# EAGLE design Mirley_ESP8266 (EAGLE 9.5.1)

## Sheet 1 of 2: Mirley board to evaluate ESP8266
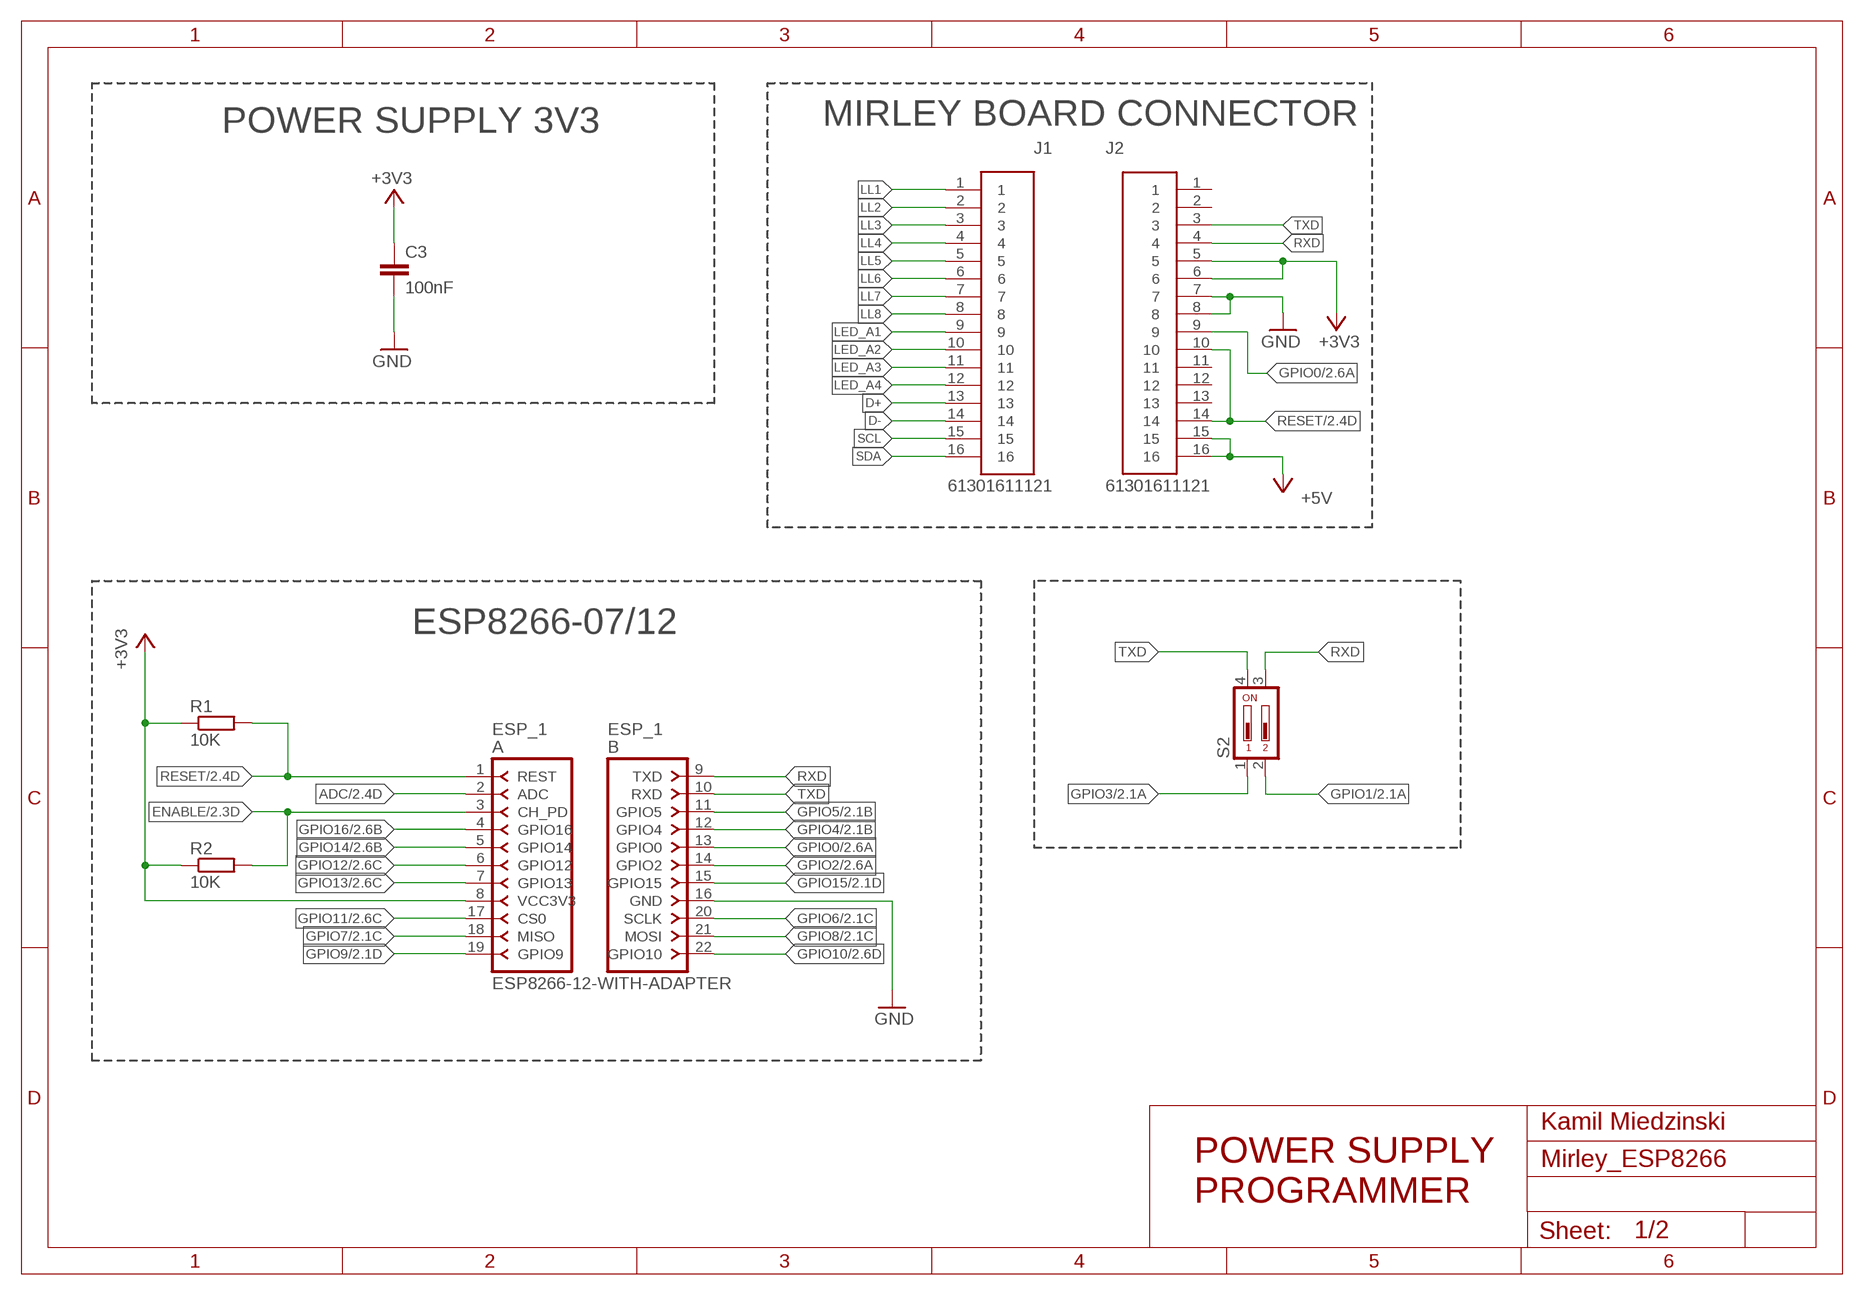
[diagram p0: schematic, sheet 1]

### Parts
C3  100nF  C-EUC0805K  [C0805K]
ESP_1  ESP8266-12-WITH-ADAPTER  [ESP8266-12-ADAPTER]
J1  61301611121  [61301611121]
J2  61301611121  [61301611121]
R1  10K  R-EU_R0805  [R0805]
R2  10K  R-EU_R0805  [R0805]
S2  DIP02YL  [DIP02YL]

### Nets
+3V3: C3.1 ESP_1.8(VCC3V3) J2.5 J2.6 R1.1 R2.1 ; also sheet 2
+5V: J2.15 J2.16 ; also sheet 2
ADC: ESP_1.2(ADC) ; also sheet 2
D+: J1.13
D-: J1.14
ENABLE: ESP_1.3(CH_PD) R2.2 ; also sheet 2
GND: C3.2 ESP_1.16(GND) J2.7 J2.8 ; also sheet 2
GPIO0: ESP_1.13(GPIO0) J2.9 ; also sheet 2
GPIO1: S2.2 ; also sheet 2
GPIO2: ESP_1.14(GPIO2) ; also sheet 2
GPIO3: S2.1 ; also sheet 2
GPIO4: ESP_1.12(GPIO4) ; also sheet 2
GPIO5: ESP_1.11(GPIO5) ; also sheet 2
GPIO6: ESP_1.20(SCLK) ; also sheet 2
GPIO7: ESP_1.18(MISO) ; also sheet 2
GPIO8: ESP_1.21(MOSI) ; also sheet 2
GPIO9: ESP_1.19(GPIO9) ; also sheet 2
GPIO10: ESP_1.22(GPIO10) ; also sheet 2
GPIO11: ESP_1.17(CS0) ; also sheet 2
GPIO12: ESP_1.6(GPIO12) ; also sheet 2
GPIO13: ESP_1.7(GPIO13) ; also sheet 2
GPIO14: ESP_1.5(GPIO14) ; also sheet 2
GPIO15: ESP_1.15(GPIO15) ; also sheet 2
GPIO16: ESP_1.4(GPIO16) ; also sheet 2
LED_A1: J1.9 ; also sheet 2
LED_A2: J1.10 ; also sheet 2
LED_A3: J1.11 ; also sheet 2
LED_A4: J1.12 ; also sheet 2
LL1: J1.1 ; also sheet 2
LL2: J1.2 ; also sheet 2
LL3: J1.3 ; also sheet 2
LL4: J1.4 ; also sheet 2
LL5: J1.5 ; also sheet 2
LL6: J1.6 ; also sheet 2
LL7: J1.7 ; also sheet 2
LL8: J1.8 ; also sheet 2
RESET: ESP_1.1(REST) J2.10 J2.14 R1.2 ; also sheet 2
RXD: ESP_1.9(TXD) J2.4 S2.3
SCL: J1.15 ; also sheet 2
SDA: J1.16 ; also sheet 2
TXD: ESP_1.10(RXD) J2.3 S2.4
Unconnected: J2.1 J2.2 J2.11 J2.12 J2.13

### Notes on the sheet
- POWER SUPPLY 3V3 | MIRLEY BOARD CONNECTOR
- ESP8266-07/12
- Kamil Miedzinski
- POWER SUPPLY
  PROGRAMMER

## Sheet 2 of 2: LOGIC LEVEL CONVERTER 3,3V - 5V
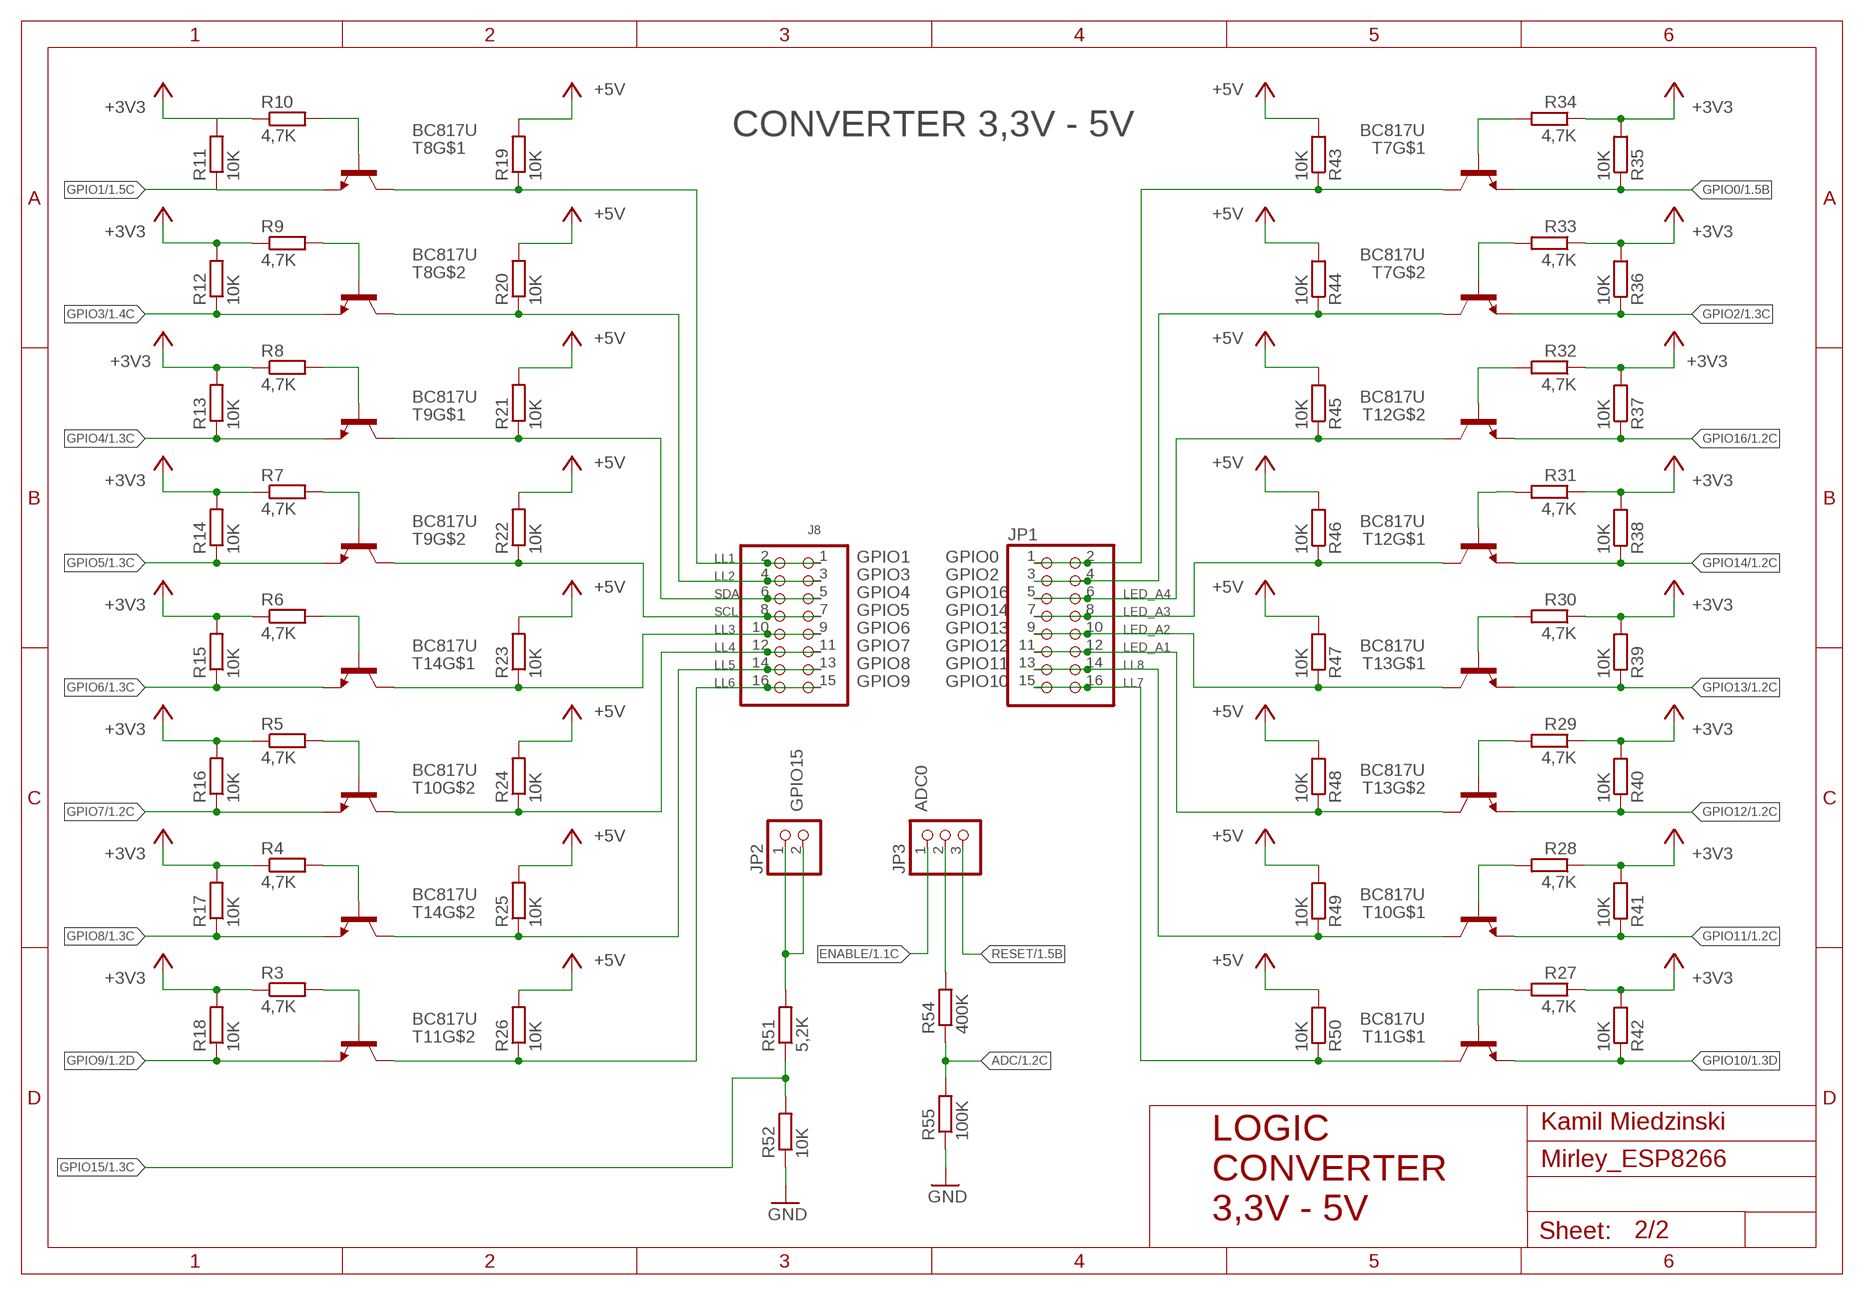
[diagram p1: schematic, sheet 2]

### Parts
J8  PINHD-2X8  [2X08]
JP1  PINHD-2X8  [2X08]
JP2  PINHD-1X2  [1X02]
JP3  PINHD-1X3  [1X03]
R3  4,7K  R-EU_R0603  [R0603]
R4  4,7K  R-EU_R0603  [R0603]
R5  4,7K  R-EU_R0603  [R0603]
R6  4,7K  R-EU_R0603  [R0603]
R7  4,7K  R-EU_R0603  [R0603]
R8  4,7K  R-EU_R0603  [R0603]
R9  4,7K  R-EU_R0603  [R0603]
R10  4,7K  R-EU_R0603  [R0603]
R11  10K  R-EU_R0805  [R0805]
R12  10K  R-EU_R0805  [R0805]
R13  10K  R-EU_R0805  [R0805]
R14  10K  R-EU_R0805  [R0805]
R15  10K  R-EU_R0805  [R0805]
R16  10K  R-EU_R0805  [R0805]
R17  10K  R-EU_R0805  [R0805]
R18  10K  R-EU_R0805  [R0805]
R19  10K  R-EU_R0805  [R0805]
R20  10K  R-EU_R0805  [R0805]
R21  10K  R-EU_R0805  [R0805]
R22  10K  R-EU_R0805  [R0805]
R23  10K  R-EU_R0805  [R0805]
R24  10K  R-EU_R0805  [R0805]
R25  10K  R-EU_R0805  [R0805]
R26  10K  R-EU_R0805  [R0805]
R27  4,7K  R-EU_R0603  [R0603]
R28  4,7K  R-EU_R0603  [R0603]
R29  4,7K  R-EU_R0603  [R0603]
R30  4,7K  R-EU_R0603  [R0603]
R31  4,7K  R-EU_R0603  [R0603]
R32  4,7K  R-EU_R0603  [R0603]
R33  4,7K  R-EU_R0603  [R0603]
R34  4,7K  R-EU_R0603  [R0603]
R35  10K  R-EU_R0805  [R0805]
R36  10K  R-EU_R0805  [R0805]
R37  10K  R-EU_R0805  [R0805]
R38  10K  R-EU_R0805  [R0805]
R39  10K  R-EU_R0805  [R0805]
R40  10K  R-EU_R0805  [R0805]
R41  10K  R-EU_R0805  [R0805]
R42  10K  R-EU_R0805  [R0805]
R43  10K  R-EU_R0805  [R0805]
R44  10K  R-EU_R0805  [R0805]
R45  10K  R-EU_R0805  [R0805]
R46  10K  R-EU_R0805  [R0805]
R47  10K  R-EU_R0805  [R0805]
R48  10K  R-EU_R0805  [R0805]
R49  10K  R-EU_R0805  [R0805]
R50  10K  R-EU_R0805  [R0805]
R51  5,2K  R-EU_R0805  [R0805]
R52  10K  R-EU_R0805  [R0805]
R54  400K  R-EU_R0805  [R0805]
R55  100K  R-EU_R0805  [R0805]
T7  BC817U  [INF-SC74]
T8  BC817U  [INF-SC74]
T9  BC817U  [INF-SC74]
T10  BC817U  [INF-SC74]
T11  BC817U  [INF-SC74]
T12  BC817U  [INF-SC74]
T13  BC817U  [INF-SC74]
T14  BC817U  [INF-SC74]

### Nets
+3V3: R3.1 R4.1 R5.1 R6.1 R7.1 R8.1 R9.1 R10.1 R11.2 R12.2 R13.2 R14.2 R15.2 R16.2 R17.2 R18.2 R27.1 R28.1 R29.1 R30.1 R31.1 R32.1 R33.1 R34.1 R35.2 R36.2 R37.2 R38.2 R39.2 R40.2 R41.2 R42.2 ; also sheet 1
+5V: R19.2 R20.2 R21.2 R22.2 R23.2 R24.2 R25.2 R26.2 R43.2 R44.2 R45.2 R46.2 R47.2 R48.2 R49.2 R50.2 ; also sheet 1
ADC: R54.1 R55.2 ; also sheet 1
ENABLE: JP3.1 ; also sheet 1
GND: R52.1 R55.1 ; also sheet 1
GPIO0: R35.1 T7.1(E) ; also sheet 1
GPIO1: R11.1 T8.1(E) ; also sheet 1
GPIO2: R36.1 T7.4(E) ; also sheet 1
GPIO3: R12.1 T8.4(E) ; also sheet 1
GPIO4: R13.1 T9.1(E) ; also sheet 1
GPIO5: R14.1 T9.4(E) ; also sheet 1
GPIO6: R15.1 T14.1(E) ; also sheet 1
GPIO7: R16.1 T10.4(E) ; also sheet 1
GPIO8: R17.1 T14.4(E) ; also sheet 1
GPIO9: R18.1 T11.4(E) ; also sheet 1
GPIO10: R42.1 T11.1(E) ; also sheet 1
GPIO11: R41.1 T10.1(E) ; also sheet 1
GPIO12: R40.1 T13.4(E) ; also sheet 1
GPIO13: R39.1 T13.1(E) ; also sheet 1
GPIO14: R38.1 T12.1(E) ; also sheet 1
GPIO15: JP2.1 JP2.2 R51.1 R51.2 R52.2 ; also sheet 1
GPIO16: R37.1 T12.4(E) ; also sheet 1
LED_A1: JP1.11 JP1.12 R48.1 T13.3(C) ; also sheet 1
LED_A2: JP1.9 JP1.10 R47.1 T13.6(C) ; also sheet 1
LED_A3: JP1.7 JP1.8 R46.1 T12.6(C) ; also sheet 1
LED_A4: JP1.5 JP1.6 R45.1 T12.3(C) ; also sheet 1
LL1: J8.1 J8.2 R19.1 T8.6(C) ; also sheet 1
LL2: J8.3 J8.4 R20.1 T8.3(C) ; also sheet 1
LL3: J8.9 J8.10 R23.1 T14.6(C) ; also sheet 1
LL4: J8.11 J8.12 R24.1 T10.3(C) ; also sheet 1
LL5: J8.13 J8.14 R25.1 T14.3(C) ; also sheet 1
LL6: J8.15 J8.16 R26.1 T11.3(C) ; also sheet 1
LL7: JP1.15 JP1.16 R50.1 T11.6(C) ; also sheet 1
LL8: JP1.13 JP1.14 R49.1 T10.6(C) ; also sheet 1
N$1: JP1.3 JP1.4 R44.1 T7.3(C)
N$2: JP3.2 R54.2
N$3: JP1.1 JP1.2 R43.1 T7.6(C)
N$4: R34.2 T7.2(B)
N$6: R10.2 T8.2(B)
N$7: R9.2 T8.5(B)
N$8: R33.2 T7.5(B)
N$12: R8.2 T9.2(B)
N$14: R32.2 T12.5(B)
N$15: R31.2 T12.2(B)
N$16: R7.2 T9.5(B)
N$20: R6.2 T14.2(B)
N$22: R30.2 T13.2(B)
N$24: R29.2 T13.5(B)
N$26: R5.2 T10.5(B)
N$27: R28.2 T10.2(B)
N$28: R4.2 T14.5(B)
N$31: R27.2 T11.2(B)
N$33: R3.2 T11.5(B)
RESET: JP3.3 ; also sheet 1
SCL: J8.7 J8.8 R22.1 T9.3(C) ; also sheet 1
SDA: J8.5 J8.6 R21.1 T9.6(C) ; also sheet 1

### Notes on the sheet
- CONVERTER 3,3V - 5V
- GPIO1 | GPIO0
- GPIO3 | GPIO2
- GPIO4 | GPIO16
- GPIO5 | GPIO14
- GPIO6 | GPIO13
- GPIO7 | GPIO12
- GPIO8 | GPIO11
- GPIO9 | GPIO10
- GPIO15 | ADC0
- Kamil Miedzinski
- LOGIC
  CONVERTER 
  3,3V - 5V

## Library data of the parts
C3 = rcl:C-EU: CAPACITOR, European symbol; SPICEPREFIX: C
ESP_1 = esp8266_with_adapter:ESP8266-12-WITH-ADAPTER: ESP8266 Adapter for ESP8266-03, ESP8266-04, ESP8266-07, ESP8266-08, ESP8266-12 and similar. (c) by Bartosz Batorek obi--wan@wp.pl
J1 J2 = Headers:61301611121: CONN HEADER VERT 16POS 2.54MM Manufacturer's datasheet <https://katalog.we-online.de/em/datasheet/6130xx11121.pdf>; CREATED_BY: PCBLayout.com; DIGIKEY_PART_NUMBER: 732-5327-ND; MANUFACTURER: Wurth Electronics Inc.; MPN: 61301611121
J8 JP1 = pinhead:PINHD-2X8: PIN HEADER
JP2 = pinhead:PINHD-1X2: PIN HEADER
JP3 = pinhead:PINHD-1X3: PIN HEADER
R1-R52 R54 R55 = rcl:R-EU_: RESISTOR, European symbol; SPICEPREFIX: R
S2 = switch-dil:DIP02YL: DIL/CODE SWITCH; OC_FARNELL: unknown; OC_NEWARK: unknown
T7-T14 = transistor:BC817U: NPN TRANSISTOR

## Board
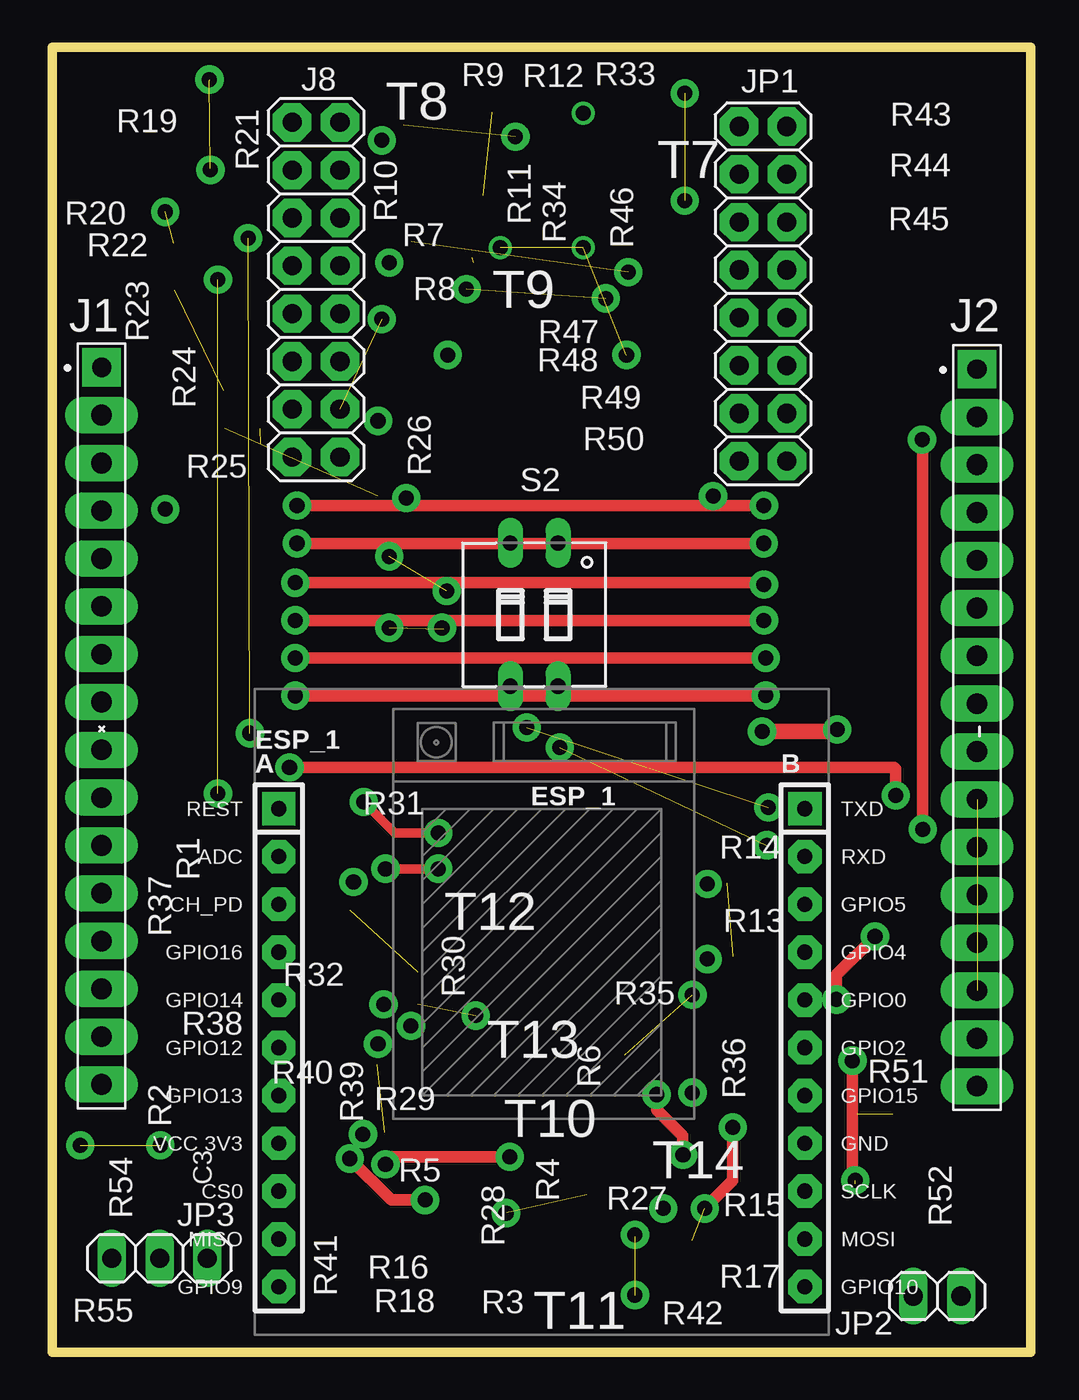
[diagram p2: board, top side]
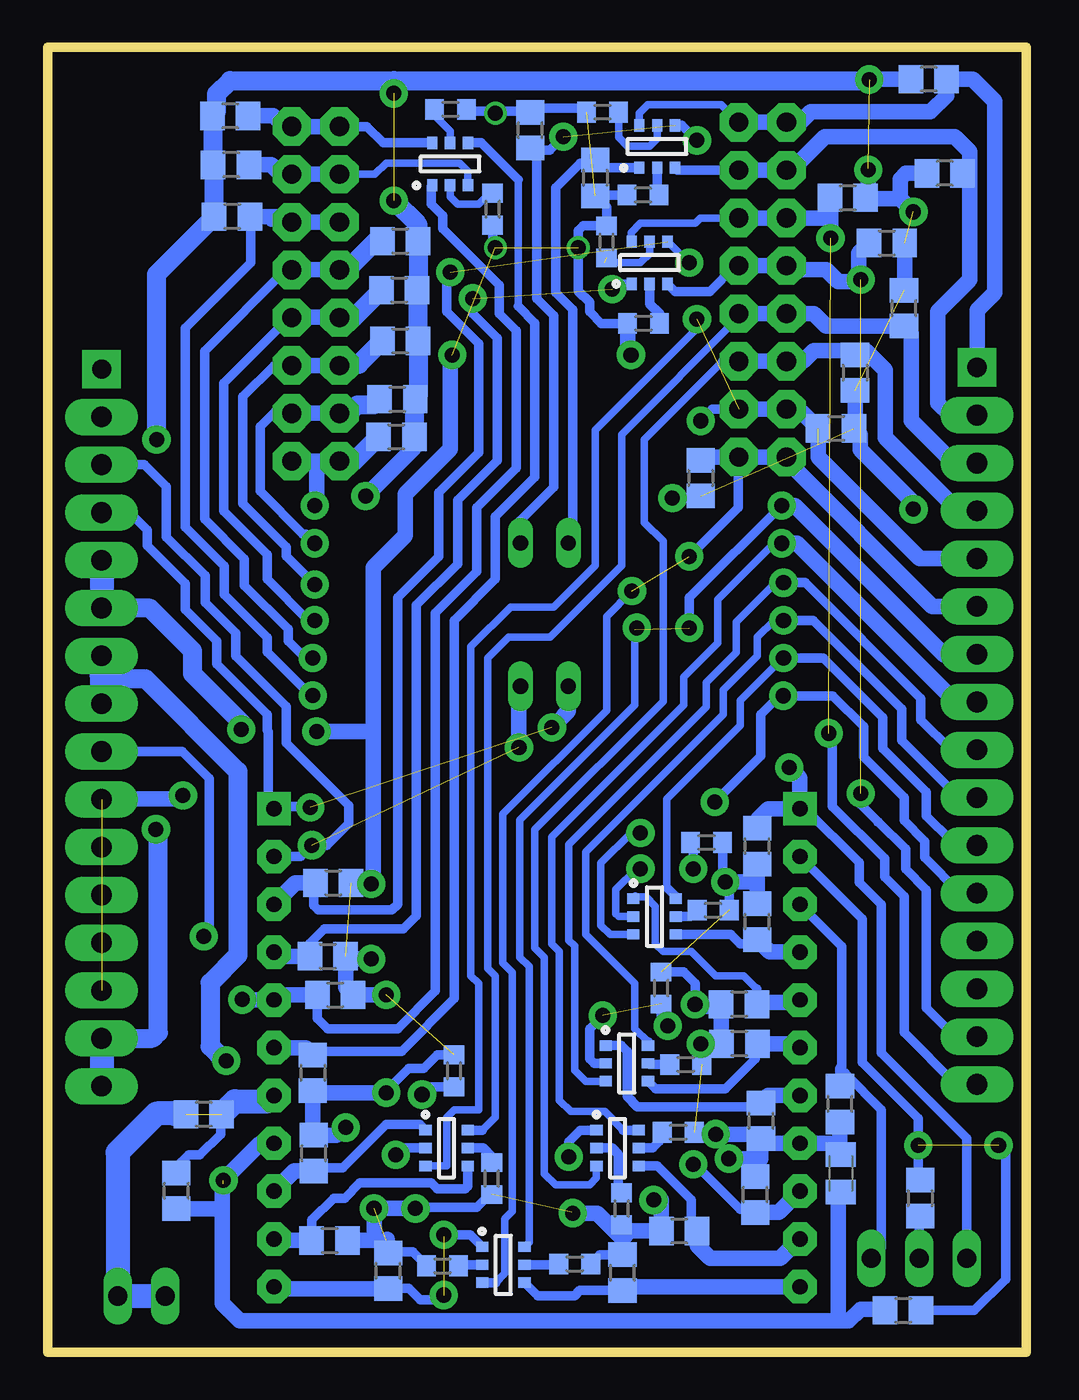
[diagram p3: board, bottom side, seen from below]

Size 51.97 x 69.36 mm. Coordinates in mm from the lower left corner, seen from the top.
Outline: 0,0 51.97,0 51.97,69.36 0,69.36 0,0
Copper layers (1*16): Top 0.035mm / dielectric 1.5mm / Bottom 0.035mm
Design rules "default *": minimum track width 6mil, minimum drill 0.35mm, track to track 20mil, track to pad 20mil, pad to pad 20mil, via to via 20mil, smd to smd 6mil, copper to edge 40mil, drill to drill 6mil, minimum pad ring 10mil, minimum via ring 8mil, stop-mask expansion 4mil, vias tented up to drill 0mil, thermal gap 10mil

### Footprints (pad centres in the part's own frame; a part is rotated, then mirrored left to right if it is on the bottom)
C0805K = smd 1.3 x 1.6: 1 -1,0; 2 1,0
ESP8266-12-ADAPTER = drill 0.813 pad 1.778 square: 1 -13.97,8.89; 9 13.97,8.89 | drill 0.813 pad 1.778 octagon: 2 -13.97,6.35; 3 -13.97,3.81; 4 -13.97,1.27; 5 -13.97,-1.27; 6 -13.97,-3.81; 7 -13.97,-6.35; 8 -13.97,-8.89; 10 13.97,6.35; 11 13.97,3.81; 12 13.97,1.27; 13 13.97,-1.27; 14 13.97,-3.81; 15 13.97,-6.35; 16 13.97,-8.89; 17 -13.97,-11.43; 18 -13.97,-13.97; 19 -13.97,-16.51; 20 13.97,-11.43; 21 13.97,-13.97; 22 13.97,-16.51
61301611121 = drill 1.016 pad 2.032 square: 1 -19.05,0 | drill 1.1 pad 1.93 long: 2 -16.51,0; 3 -13.97,0; 4 -11.43,0; 5 -8.89,0; 6 -6.35,0; 7 -3.81,0; 8 -1.27,0; 9 1.27,0; 10 3.81,0; 11 6.35,0; 12 8.89,0; 13 11.43,0; 14 13.97,0; 15 16.51,0; 16 19.05,0
2X08 = drill 1.016 pad 2.032 octagon: 1 -8.89,-1.27; 2 -8.89,1.27; 3 -6.35,-1.27; 4 -6.35,1.27; 5 -3.81,-1.27; 6 -3.81,1.27; 7 -1.27,-1.27; 8 -1.27,1.27; 9 1.27,-1.27; 10 1.27,1.27; 11 3.81,-1.27; 12 3.81,1.27; 13 6.35,-1.27; 14 6.35,1.27; 15 8.89,-1.27; 16 8.89,1.27
1X02 = drill 1.016 long: 1 -1.27,0; 2 1.27,0
1X03 = drill 1.016 long: 1 -2.54,0; 2 0,0; 3 2.54,0
R0805 = smd 1.3 x 1.5: 1 -0.95,0; 2 0.95,0
R0603 = smd 1 x 1.1: 1 -0.85,0; 2 0.85,0
DIP02YL = drill 0.813 long: 1 -1.27,-3.81; 2 1.27,-3.81; 3 1.27,3.81; 4 -1.27,3.81
INF-SC74 = smd 0.65 x 0.55: 1 -1.125,0.95; 2 -1.125,0; 3 -1.125,-0.95; 4 1.125,-0.95; 5 1.125,0; 6 1.125,0.95

### Placement (x,y rotation side)
C3  9.85,9.51 270 bottom
ESP_1  26,20 0 top
J1  2.62,33.29 270 top
J2  49.12,33.2 270 top
J8  14.01,56.47 270 top
JP1  37.75,56.25 270 top
JP2  47,3 0 top
JP3  5.7,5 180 top
R1  14.3,26.9 90 bottom
R2  9.9,13.2 90 bottom
R3  23.99,4.7 180 bottom
R4  28.4,9.24 90 bottom
R5  18.49,11.7 180 bottom
R6  30.4,14.96 270 bottom
R7  22.3,59.01 270 bottom
R8  20.34,54.68 0 bottom
R9  22.51,65.9 0 bottom
R10  20.36,61.5 0 bottom
R11  22.9,62.41 270 bottom
R12  26.35,64.94 90 bottom
R13  37.11,21.05 0 bottom
R14  36.81,24.95 0 bottom
R15  37.85,10.59 90 bottom
R16  18.44,6.45 180 bottom
R17  37.01,5.95 0 bottom
R18  21.45,4.24 90 bottom
R19  5.19,67.65 180 bottom
R20  4.34,62.65 180 bottom
R21  9.49,61.35 0 bottom
R22  7.41,58.95 0 bottom
R23  6.5,55.49 90 bottom
R24  9.1,52.06 270 bottom
R25  10.11,49.1 0 bottom
R26  17.3,46.46 270 bottom
R27  31.01,4.6 0 bottom
R28  21.5,7.64 90 bottom
R29  18.09,15.3 180 bottom
R30  19.4,19.36 270 bottom
R31  16.99,27.1 180 bottom
R32  16.64,23.5 180 bottom
R33  30.59,66.05 180 bottom
R34  28.35,60.74 90 bottom
R35  36.71,19 0 bottom
R36  37.9,14.86 270 bottom
R37  14.3,22.89 90 bottom
R38  15.26,18.5 180 bottom
R39  14.1,12.31 270 bottom
R40  15.24,16.4 180 bottom
R41  14.4,8.39 90 bottom
R42  33.9,4.34 90 bottom
R43  42.29,65.7 180 bottom
R44  42.24,63.1 180 bottom
R45  42.19,60.35 180 bottom
R46  33.26,59.05 0 bottom
R47  33.31,56.45 0 bottom
R48  33.26,53.75 0 bottom
R49  33.41,50.65 0 bottom
R50  33.46,48.65 0 bottom
R51  43.69,12.65 180 bottom
R52  45.15,8.59 90 bottom
R54  5.64,8.2 270 bottom
R55  6.55,2.24 0 bottom
S2  25.6,39.2 180 top
T7  30.61,63.14 90 bottom
T8  19.61,64.07 90 bottom
T9  20.01,57.9 90 bottom
T10  21.71,10.86 0 bottom
T11  27.78,4.66 0 bottom
T12  19.75,23.16 0 bottom
T13  21.22,15.36 0 bottom
T14  30.79,10.86 0 bottom

### Tracks (layer width: path | path; a pad name or v marks a point on that pad's centre or on a via)
+3V3  (via drill 0.8, 0.8 pad 1.5)  (9 unrouted)
  Top 0.508: 32.6,7.5 v32.45,7.65
  Top 0.61: v36.15,11.95 36.15,9.15 v34.65,7.65 | v19.8,8.1 18,8.1 v15.8,10.3
  Top 0.813: v41.7,33.1 41.6,33 v37.7,33 | v24.1,7.4 24.15,7.45
  Bottom 0.508: R18.2 22.65,5.19 R3.1 | R27.1 32.6,5.34 33.95,5.34 | R28.1 21.5,6.1 21.45,6.05 | R5.1 16.6,11.7 v16.5,11.6 | R4.1 28.51,8.39 29.2,7.7 32.4,7.7 v32.45,7.65 | R6.1 31.29,15.81 32,15.1 32.8,15.1 34,13.9 v34,13.8 | R29.1 17.3,15.36 v17.3,16.4 | v17.6,18.5 17.6,19.6 18.21,20.21 R30.1 | R32.1 15.79,24.79 v16,25 16.14,25.14 R31.1 | 21.21,61.3 R10.1 22.86,61.5 R11.2 | R9.1 23.56,66.1 26.14,66.1 R12.2 26.41,65.95 28.1,65.95 v28.2,65.85 28.3,65.95 29.64,65.95 R33.1 | R11.2 22.96,61.4 | R11.2 22.3,60.86 R7.1 | 21.21,54.7 R8.1 22.58,54.68 23.2,55.3 23.2,55.8 23.8,56.4 v23.8,58.7 23.8,59.6 23.54,59.86 R7.1 | 22.54,60.1 R7.1 | R34.1 28.35,58.85 v28.2,58.7
  Bottom 0.813: R2.1 9.9,10.56 C3.1 10.45,11.11 ESP_1.8 13.85,11.11 R39.2 | 37.1,33 v37.7,33 34.7,33 | R1.1 14.3,25 | 14.3,25 R37.2 | 21.45,6.05 R18.2 | 21.45,6.05 21.05,6.45 R16.2 19.39,8.1 v19.8,8.1 | R41.2 14.4,10.3 | R39.2 14.1,10.3 14.4,10.3 | v34.8,24.9 34.85,24.95 R14.2 34.7,24.95 34.7,33 | v34.8,20.9 36.01,20.9 R13.2 36.16,19.4 R35.2 v34,19 | v34,13.8 37.79,13.8 R36.2 37.9,11.59 R15.2 36.66,11.54 36.25,11.95 v36.15,11.95 | v32.45,7.65 v34.65,7.65 34.65,5.95 R17.2 | v24.1,7.4 22.8,7.4 21.45,6.05 | R42.2 33.95,5.34 33.95,6 34,5.95 | v15.8,10.3 14.4,10.3 | R39.2 14.34,11.6 v16.5,11.6 | v17.3,16.4 R40.2 16.21,16.42 R38.2 16.31,18.4 17.5,18.4 v17.6,18.5 | v16,25 14.3,25 | 34.7,33 34.7,41.7 33,43.4 33,45.6 30.6,48 30.6,52.9 v30.5,53 | v21,53 21.19,53.19 R8.1
  Bottom 1.016: v41.7,33.1 41.7,33.47 44.29,36.05 44.29,37.28 46.56,39.55 J2.6
  Bottom 1.27: J2.5 J2.6
+5V  (via drill 0.8 pad 1.5)  (6 unrouted)
  Top 0.61: v46.23,27.8 46.23,48.47
  Top 0.813: 46.23,48.47 v46.2,48.5
  Bottom 0.508: R26.2 17.41,45.4 v18.8,45.4
  Bottom 0.813: R23.2 6.46,56.48 R22.2 | R20.2 6.4,62.65 6.7,62.35 6.7,61.3 | 8.4,62.9 v8.4,62.84 8.4,61.49 | 8.4,61.49 R21.2 | R19.2 8.33,67.65 v8.35,67.64 | R24.2 9.1,49.16 R25.2 8.82,48.76 8.82,47.97 5.8,44.95 5.8,44.7 6,44.7 v6,44.8 | v6,60.6 6.7,61.3 | 8.4,61.49 8.21,61.3 6.7,61.3 | R50.2 32.51,48.09 v35.1,45.5
  Bottom 1.016: J2.15 46.41,16.69 46.1,17 46.1,27.8 v46.23,27.8 | v46.2,48.5 46.2,57.29 R45.2 43.14,63.05 R44.2 43.19,65.65 R43.2 43.01,65.93 43.01,66.87 42.3,67.58 33.6,67.58 | 32.2,59.16 R46.2 | R46.2 32.31,56.45 | 32.31,56.45 R47.2 | 33.6,67.58 8.33,67.58 | v33.6,66.9 33.6,67.58 | R50.2 32.51,50.6 R49.2 32.31,50.8 R48.2 32.31,56.45 | R46.2 32.31,59.91 v33.6,61.2
  Bottom 1.27: J2.15 J2.16
ADC  (via drill 0.8 pad 1.5)  (1 unrouted)
  Bottom 0.508: ESP_1.2 8.72,23.04 8.72,15.43 5.74,12.45 v5.74,11 5.74,9.25 R54.1 | v1.48,11 1.1,10.62 1.1,3.9 2.76,2.24 R55.2
ENABLE
  Bottom 0.508: ESP_1.3 9.8,21.58 9.8,15 | 9.8,15 9.9,15.1 R2.2 | JP3.1 7.7,5.54 7.7,12.9 9.6,14.8 9.8,15
GND  (via drill 0.8 pad 1.5)  (1 unrouted)
  Top 0.61: v42.5,15.5 42.5,9.3
  Top 1.016: 42.5,9.3 v42.65,9.15
  Bottom 0.813: 10,1.68 41.78,1.68 42.7,2.6 42.7,7.5 | 10,1.68 9.42,1.68 8.8,2.3 7.56,2.3 R55.1 | ESP_1.16 40.69,11.11 v42.65,9.15 | 42.65,8.95 42.7,8.9 42.7,7.5 | R52.1 42.84,7.64 42.7,7.5 | C3.2 10,8.36 10,1.68
  Bottom 1.016: 49.12,36 48.92,35.8 46.8,35.8 41.88,30.88 41.88,21.12 43.35,19.65 43.35,16.25 42.6,15.5 v42.5,15.5
  Bottom 1.27: J2.7 49.12,36 J2.8
GPIO0  (via drill 0.8 pad 1.5)
  Top 0.61: v41.65,18.75 41.65,20.05 v43.7,22.1
  Bottom 0.508: 41.67,18.73 v41.65,18.75 | J2.9 44.83,31.93 43.4,30.5 43.4,22.4 v43.7,22.1 | R35.1 37.66,17.76 37.1,17.2 33.4,17.2 31.4,19.2 31.4,39.3 29.2,41.5 29.2,44.9 27.1,47 27.1,54.3 28,55.2 28,56.7 31,59.7 31,60.4 31.6,61 31.6,61.98 T7.1
  Bottom 0.813: 41.67,18.73 ESP_1.13 39.7,19 R35.1
GPIO1
  Bottom 0.508: T8.1 22.48,62.95 R11.1 23.06,63.2 23.7,63.2 25,61.9 25,56.3 24.1,55.4 24.1,43.24 S2.2
GPIO2
  Bottom 0.406: 27,55.6 27,62.3
  Bottom 0.508: R36.1 37.8,15.81 37.6,16.01 33.19,16.01 30.4,18.8 30.4,38.9 28.2,41.1 28.2,44.4 26.1,46.5 26.1,54.7 27,55.6 | T7.4 28.96,64.27 27,62.3
  Bottom 0.813: ESP_1.14 38.28,16.19 R36.1
GPIO3  (via drill 0.8 pad 1.5)  (1 unrouted)
  Bottom 0.508: T8.4 18.3,65.19 v17.5,64.4 | v24.6,64.6 25.31,63.89 26,63.89 | R12.1 26,63.99 26,63.89 | S2.1 26.87,44.21 25.1,45.98 25.1,55.1 26,56 26,63.89
GPIO4  (via drill 0.8 pad 1.5)  (1 unrouted)
  Bottom 0.508: R13.1 38.06,21.74 37.3,22.5 33.1,22.5 32.4,23.2 32.4,39.7 30.2,41.9 30.2,45.3 28.1,47.4 28.1,53.9 29.4,55.2 v29.4,56 | T9.1 21.93,56.77 22,56.7 v22,56.5
  Bottom 0.813: R13.1 39.75,21.05 ESP_1.12
GPIO5  (via drill 0.8 pad 1.5)  (1 unrouted)
  Bottom 0.406: T9.4 17.93,57.9 v17.9,57.9
  Bottom 0.508: R14.1 37.86,24.85 37.86,23.76 37.6,23.5 33.7,23.5 33.4,23.8 33.4,40.1 31.2,42.3 31.2,45.7 29.1,47.8 29.1,53.6 30.8,55.3 30.8,57.2 v30.6,57.4
  Bottom 0.61: R14.1 38.01,25.2
  Bottom 0.813: R14.1 38.83,24.95 ESP_1.11
GPIO6
  Bottom 0.508: R15.1 37.69,9.8 36.3,9.8 33.99,12.11 32.22,12.11 T14.1
  Bottom 0.813: R15.1 38.9,9.64 ESP_1.20
GPIO7
  Bottom 0.508: R16.1 17.8,6.76 17.8,8.1 19.61,9.91 T10.4
  Bottom 0.813: ESP_1.18 13.06,5 16.8,5 17.49,5.69 R16.1
GPIO8
  Bottom 0.508: R17.1 37.96,7.04 36.8,8.2 36.2,8.2 35.4,9 31.6,9 31.3,8.7 29.8,8.7 29.66,8.84 T14.4
  Bottom 0.813: R17.1 39.89,5.95 ESP_1.21
GPIO9
  Bottom 0.508: R18.1 23.71,3.29 24,3 25.95,3 T11.4
  Bottom 0.813: ESP_1.19 21.25,3.49 R18.1
GPIO10  (via drill 0.8 pad 1.5)  (1 unrouted)
  Top 0.508: 30.95,6.15 30.9,6.2 v30.95,6.25
  Bottom 0.508: R42.1 33.21,3.39 33.2,3.4 32.8,3.4 32.2,2.8 31.1,2.8 30.9,3 v30.95,3.05 | v30.95,6.25 29.55,6.25 T11.1
  Bottom 0.813: R42.1 39.87,3.39 ESP_1.22
GPIO11  (via drill 0.8 pad 1.5)
  Top 0.508: v17.7,10 18.1,10.4 | 24.6,10.4 v24.3,10.4
  Top 0.61: v24.3,10.4 18.1,10.4
  Bottom 0.508: R41.1 14.56,7.6 15.2,7.6 17.6,10 v17.7,10 | T10.1 23.69,11.81 24.3,11.2 v24.3,10.4
  Bottom 0.813: ESP_1.17 13.16,7.44 R41.1
GPIO12
  Bottom 0.508: R40.1 14.4,16.29 14.4,15.6 16,14 19.68,14 T13.4
  Bottom 0.813: ESP_1.6 12.29,16.19 12.5,16.4 R40.1
GPIO13
  Bottom 0.508: R39.1 14.3,13.06 20.66,13.06 21.2,13.6 21.2,16 21.51,16.31 T13.1
  Bottom 0.813: R39.1 13.71,13.65 ESP_1.7
GPIO14
  Bottom 0.406: 14.31,19.31 15,20 16.5,20 17.8,21.3 19.3,21.3 19.7,21.7 19.7,23.7 20.2,24.2 20.79,24.2
  Bottom 0.508: R38.1 14.31,19.31 | 20.79,24.2 T12.1
  Bottom 0.813: ESP_1.5 12.27,18.73 12.4,18.6 14.21,18.6 R38.1
GPIO15  (1 unrouted)
  Bottom 0.508: R51.1 42.8,12.59 42.8,11.6 43.9,10.5 44.5,10.5 45.15,9.85 R52.2
  Bottom 1.27: R51.1 42.04,13.35 40.27,13.35 ESP_1.15 | R51.2 45.15,12.65 45.2,12.7 46.2,12.7 48.27,10.63 JP2.2 JP2.1
GPIO16
  Bottom 0.508: T12.4 15.71,22.21 15.2,21.7 14.54,21.7 R37.1
  Bottom 0.813: ESP_1.4 13.63,21.27 R37.1
LED_A1  (via drill 0.8 pad 1.5)
  Top 0.61: v12.9,40.9 37.7,40.9
  Top 0.813: 37.7,40.9 v37.8,40.8
  Bottom 0.406: T13.3 23.41,14.41 24,15 24,21.6 24.3,21.9 24.3,27 17,34.3 17,35.6 15.4,37.2 15.4,38.8 13.3,40.9
  Bottom 0.508: JP1.12 39.96,52.44 41.62,50.78 41.62,45.12 39.3,42.8 39.3,42.3 v37.8,40.8 37.8,40.9 | J1.9 3.98,32.02 4,32 5.6,33.6 5.6,34.75 11.75,40.9 12.8,40.9 13.3,40.9 | 34,53.96 R48.1
  Bottom 0.813: JP1.11 JP1.12 39.08,52.5 | 12.8,40.9 v12.9,40.9
  Bottom 1.016: R48.1 35.46,52.5 36.42,52.5 JP1.11
LED_A2  (via drill 0.8 pad 1.5)
  Top 0.61: v12.9,38.9 v37.8,38.9
  Bottom 0.406: 20.09,16.5 20.8,17.2 20.8,19.6 23.4,22.2 23.4,26.6 16.1,33.9 16.1,35.2 14.3,37 14.3,38 13.4,38.9 v12.9,38.9
  Bottom 0.508: v37.8,38.9 38.14,38.9 40.32,41.08 40.32,42.38 42.63,44.7 42.63,51.51 39.16,54.98 JP1.10 | J1.10 3.58,29.48 6.62,32.52 6.62,34.2 11.32,38.9 v12.9,38.9 | T13.6 20.09,16.5
  Bottom 0.813: J1.10 2.66,29.44 | v12.9,38.9 12.72,38.9 | JP1.10 39.04,55 36.5,55 JP1.9
  Bottom 1.016: R47.1 35.71,55 36.5,55
LED_A3  (via drill 0.8 pad 1.5)
  Top 0.61: v12.9,36.9 v37.9,36.9
  Bottom 0.406: 12.94,36.9 15.2,34.64 15.2,33.3 19.1,29.4 19.1,24.7
  Bottom 0.508: v37.9,36.9 38.3,36.9 39.21,37.81 39.21,38.44 41.54,40.76 41.54,42.16 43.65,44.27 43.65,53.21 39.34,57.52 JP1.8 | 3.5,26.95 3.5,26.8 2.76,26.8 2.66,26.9 | J1.11 2.88,27.2 4,27.2 5.31,28.51 5.31,29.78 7.63,32.09 7.63,33.73 10.8,36.9 v12.9,36.9 12.94,36.9 | T12.6 18.62,24.23 19.1,24.7
  Bottom 0.813: 2.66,26.9 J1.11 | JP1.7 JP1.8
  Bottom 1.016: JP1.7 36.08,57.52 34.55,59.05 R46.1
LED_A4  (via drill 0.8 pad 1.5)
  Top 0.508: v20.5,27.6 18.2,27.6 v16.55,29.25
  Top 0.61: v12.91,34.89 v37.89,34.89
  Top 0.813: v37.89,34.89 v37.9,34.9
  Bottom 0.406: T12.3 22.11,22.21 22.6,22.7 22.6,26 21,27.6 v20.5,27.6
  Bottom 0.508: 37.9,35.16 v37.9,34.9 38,34.9 40.31,37.21 40.31,37.98 42.6,40.26 42.6,41.79 44.66,43.85 44.66,54.43 41.2,57.89 41.2,60.31 R45.1 | 40.14,60.06 JP1.6 | J1.12 3.5,24.4 5.4,26.3 5.4,27.16 6.5,28.26 6.5,29.5 8.65,31.65 8.65,33.25 10.29,34.89 v12.91,34.89 12.91,34.81 12.9,34.8 13.2,34.8 14.1,33.9 14.1,31.7 v16.55,29.25
  Bottom 0.813: J1.12 3.6,24.4 | JP1.5 JP1.6 39.31,60.35 R45.1
LL1
  Bottom 0.406: J8.2 16.22,66.3 20.1,66.3 20.56,65.84 T8.6
  Bottom 0.813: J8.2 J8.1 12.01,65.36 11.45,65.92 5.1,65.92 4.24,66.78 R19.1 2.85,67.65 1.68,66.48 1.68,56.32 2.62,55.38 J1.1
LL2
  Bottom 0.508: R20.1 3,62.26 | J8.4 18.54,62.82 T8.3
  Bottom 0.813: J8.4 J8.3 12.48,62.82 10.7,64.6 3.8,64.6 3,63.8 3,62.26 3,57 4.7,55.3 4.7,50.45 4.05,49.8 J1.2
LL3
  Bottom 0.406: 28.89,11.81 28.2,12.5 28.2,20 28.6,20.4 28.6,36.9 27.5,38 25.3,38 21.5,41.8 21.5,48.78 15.28,55
  Bottom 0.508: T14.6 28.89,11.81 | 15.28,55.12 J8.10 15.28,55
  Bottom 0.813: J1.3 3.86,47.26 6.12,49.52 6.12,54.16 R23.1 10.64,54.54 11.3,55.2 J8.9 J8.10
LL4
  Bottom 0.406: T10.3 22.84,9.27 23.2,8.9 25,8.9 25.6,9.5 25.6,21 26.1,21.5 26.1,27.8 19.3,34.6 19.3,43.1 20.3,44.1 20.3,48.5 16.14,52.66
  Bottom 0.508: 16.14,52.66 15,52.66
  Bottom 0.813: 3.92,44.72 J1.4 3.34,44.72 3.38,44.68 3.56,44.68 7.5,48.62 7.5,52.2 8.52,53.22 9,53.22 | 15.64,52.66 J8.12 15,52.66 J8.11 11.86,52.66 11.3,53.22 9,53.22 | R24.1 9,53.11 9,53.22
LL5  (via drill 0.8 pad 1.5)  (2 unrouted)
  Bottom 0.406: T14.3 30.8,9.91 30.8,12.5 30.4,12.9 29.1,12.9 29.1,19.6 29.5,20 29.5,37.5 27.4,39.6 25.1,39.6 22.9,41.8 22.9,49 17.5,54.4
  Bottom 0.508: v17.3,49.5 16.68,50.12 J8.14 | 17.5,54.4 v17.5,54.9
  Bottom 0.813: J8.13 J8.14 | J8.13 12.62,50 11.96,50 R25.1 | 3.7,42.18 J1.5 5.67,42.18 11.06,47.57 11.06,48.27 | 12.74,49.95 J8.13
LL6  (via drill 0.8 pad 1.5)  (1 unrouted)
  Bottom 0.406: 28.19,3.71 27.7,4.2 27.7,7.1 27.3,7.5 27.3,20.2 27.8,20.7 27.8,28.6 22.3,34.1 22.3,39.1 v20.95,40.45
  Bottom 0.508: T11.3 28.19,3.71 | v17.9,42.3 15.3,44.9 15.3,47.56 J8.16
  Bottom 0.813: 3.8,39.64 J1.6 5,39.64 12.74,47.38 J8.15 J8.16 17.13,47.58 R26.1
LL7  (via drill 0.8 pad 1.5)  (1 unrouted)
  Top 0.61: v13,45 v37.8,45
  Bottom 0.406: T11.6 26.4,5.87 26.4,20.5 26.9,21 26.9,28.3 20.8,34.4 20.8,38.4 v20.7,38.5
  Bottom 0.508: v17.9,38.5 17.9,40.1 v13,45
  Bottom 0.813: J1.7 2.66,37.06 4.36,37.06 12.3,45 v13,45 | v37.8,45 37.7,45.1 37.7,47.1 37.96,47.36 JP1.16 JP1.15
  Bottom 1.016: JP1.15 35.7,47.36 R50.1
LL8  (via drill 0.8 pad 1.5)
  Top 0.61: v13,42.99 v37.79,42.99
  Bottom 0.406: 21.41,11.81 22.4,12.8 24.2,12.8 24.8,13.4 24.8,21.3 25.2,21.7 25.2,27.4 18.2,34.4 18.2,35.9 16.4,37.7 16.4,40 13.41,42.99
  Bottom 0.508: v37.79,42.99 38.29,43.49 38.43,43.49 40.7,45.76 40.7,49.2 39.9,50 39.12,50 | T10.6 21.41,11.81 | v13,42.99 13.41,42.99
  Bottom 0.813: J1.8 3.76,34.56 12.2,43 v13,43 v13,42.99 | 39.12,50 JP1.14 JP1.13
  Bottom 1.016: JP1.13 35.98,49.9 35.53,50.35 34.66,50.35 R49.1
N$1
  Bottom 0.406: T7.3 29.66,62.76 30.1,63.2 34,63.2 34.6,62.6 JP1.3
  Bottom 0.813: JP1.3 JP1.4 39.6,62.6 40.1,63.1 R44.1
N$2
  Bottom 0.508: JP3.2 5.7,7.19 R54.2
N$3
  Bottom 0.508: 36.46,65.16 JP1.1 35.04,65.14 34.16,64.27 T7.6
  Bottom 0.813: JP1.1 JP1.2 39.44,65.14 40,65.7 R43.1
N$4
  Bottom 0.406: T7.2 30.61,61.41 30.2,61 29.1,61 28.51,61.59
  Bottom 0.508: R34.2 28.51,61.59
N$6
  Bottom 0.508: T8.2 19.61,61.6 R10.2
N$7
  Bottom 0.406: T8.5 19.61,64.49 20,64.1 21.2,64.1 21.66,64.56 R9.2
N$8
  Bottom 0.406: 31.44,65.74 30.6,64.9 T7.5
  Bottom 0.508: R33.2 31.44,65.74 | T7.5
N$12
  Bottom 0.508: T9.2 20.01,55.71 19.49,55.19 R8.2
N$14
  Bottom 0.508: R32.2 17.83,23.16 T12.5
N$15  (via drill 0.8 pad 1.5)
  Top 0.508: v20.5,25.7 v17.7,25.7
  Bottom 0.406: T12.2 21.66,23.16 21.8,23.3 21.8,24.6 20.7,25.7
  Bottom 0.508: 20.7,25.7 v20.5,25.7 | v17.7,25.7 17.7,26.96 R31.2
N$16  (1 unrouted)
  Bottom 0.406: T9.5 20.01,58.39 20.5,57.9 22.4,57.9
  Bottom 0.508: R7.2 22.4,58.16
N$20  (via drill 0.8 pad 1.5)
  Top 0.61: v33.5,10.5 33.5,11.5 32.1,12.9 v32.1,13.7
  Bottom 0.508: T14.2 33.14,10.86 v33.5,10.5 | R6.2 31.69,14.11 v32.1,13.7
N$22  (via drill 0.8 pad 1.5)  (1 unrouted)
  Top 0.508: 18.95,17.45 v19.05,17.35
  Bottom 0.508: T13.2 22.96,15.36 23.2,15.6 23.2,17.2 v22.5,17.9 | R30.2 19.4,17.7 v19.05,17.35
N$24
  Bottom 0.508: R29.2 20.04,15.3 T13.5
N$26
  Bottom 0.508: R5.2 19.5,11.54 19.5,11.22 19.86,10.86 T10.5
N$27
  Bottom 0.508: R28.2 21.67,8.66 21.67,10.53 22.01,10.86 T10.2
N$28
  Bottom 0.508: R4.2 28.4,10.4 28.86,10.86 T14.5
N$31
  Bottom 0.508: 30.21,4.65 30.2,4.66 | T11.2 30.2,4.66 | R27.2 30.22,4.66 30.2,4.66
N$33
  Bottom 0.508: R3.2 24.84,4.66 T11.5
RESET  (via drill 0.8 pad 1.5)  (1 unrouted)
  Top 0.61: v44.8,29.6 44.8,31 44.72,31.08 v12.6,31.08
  Bottom 0.508: JP3.3 3.16,11.37 7.7,15.91 7.7,23.8 8.88,24.98 8.88,26.03 11.73,28.89 ESP_1.1
  Bottom 0.813: v12.6,31.08 12.58,31.08 12.03,30.53 ESP_1.1 13.71,28.89 14.3,28.3 R1.2 | J2.10 47.52,29.39 47.51,29.4 45,29.4 v44.8,29.6
RXD  (via drill 0.8 pad 1.5)  (1 unrouted)
  Bottom 0.508: 48.4,44.6 49.09,44.6 J2.4 47.63,44.63 46.7,43.7 46.7,42.88 44.68,40.86 44.68,39.47 43.02,37.8 43.02,36.58 40.33,33.89 40.33,33.05 40.27,32.99 40.27,29.19 ESP_1.9 39.86,29 38,29 v38.04,28.96
  Bottom 0.813: S2.3 24.33,34.09 24.6,33.82 24.6,33.8 v25.2,33.2
SCL  (via drill 0.8 pad 1.5)  (1 unrouted)
  Bottom 0.508: J1.15 2.64,16.8 3.8,16.8 5.31,18.31 5.31,24.18 | 5.32,24.18 5.31,24.18 | 5.31,24.18 5.31,24.58 6.42,25.68 6.42,26.74 7.87,28.2 | 7.87,28.2 7.9,28.2 | 7.87,28.2 8.8,29.13 v8.8,29.7 | J8.8 15.46,57.74 16.82,56.38 18.66,56.38 T9.3
  Bottom 0.813: J8.8 J8.7 12.54,57.54 10.64,57.54 10,56.9 8.9,56.9 | 8.9,56.9 v8.8,57 | R22.1 8.9,58.41 8.9,56.9
SDA  (via drill 0.8 pad 1.5)  (1 unrouted)
  Bottom 0.406: J8.6 17.32,60.28 17.6,60 20.5,60 21,59.5 21,59.06
  Bottom 0.508: J1.16 3.74,14.24 6.5,17 6.5,24.23 7.53,25.26 7.53,26.24 10.3,29.01 10.3,32.7 v10.5,32.9 | 21,59.06 T9.6
  Bottom 0.813: J8.6 J8.5 10.48,60.28 10.4,60.2 v10.4,59.2 10.4,61.31 R21.1
TXD  (via drill 0.8 pad 1.5)  (1 unrouted)
  Bottom 0.508: J2.3 46.85,47.17 45.68,46 45.68,43.33 43.62,41.27 43.62,39.84 42,38.23 42,37 39.31,34.31 39.31,32.37 36,29.06 36,28.1 37.15,26.95 v37.95,26.95 38.55,26.35 ESP_1.10
  Bottom 0.813: 27,35.26 S2.4 26.95,35.31 v26.95,32.15

### Text on the board
Reference: GPIO1 | TXD0 | GPIO0 | RXD0 | GPIO3 | GPIO2 | TXD1 | SDA | GPIO4 | GPIO16 | WAKE | SCL | GPIO5 | GPIO14 | SCLK | GPIO6 | GPIO13 | MOSI | GPIO7 | GPIO12 | MISO | GPIO8 | GPIO11 | GPIO9 | GPIO10 | GPIO1,3 ON | ESP8266-07 | CS | RESET | ADC 0-5V | CH_PD | ESP8266-12 | GPIO15